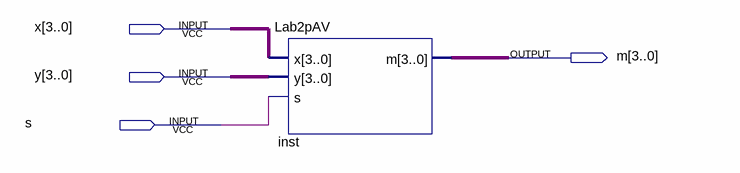
[diagram p0: schematic sheet]
// Quartus schematic Lab2pA.bdf as structural Verilog: 1 symbols, 4 pins
module Lab2pA (
  input  [3:0] x,
  input  [3:0] y,
  input  s,
  output [3:0] m
);

  Lab2pAV inst (.x(x), .y(y), .s(s), .m(m));
endmodule
